# Altium schematic sheet IO.SchDoc
size A3; SheetNumber: 4; SheetTotal: 14
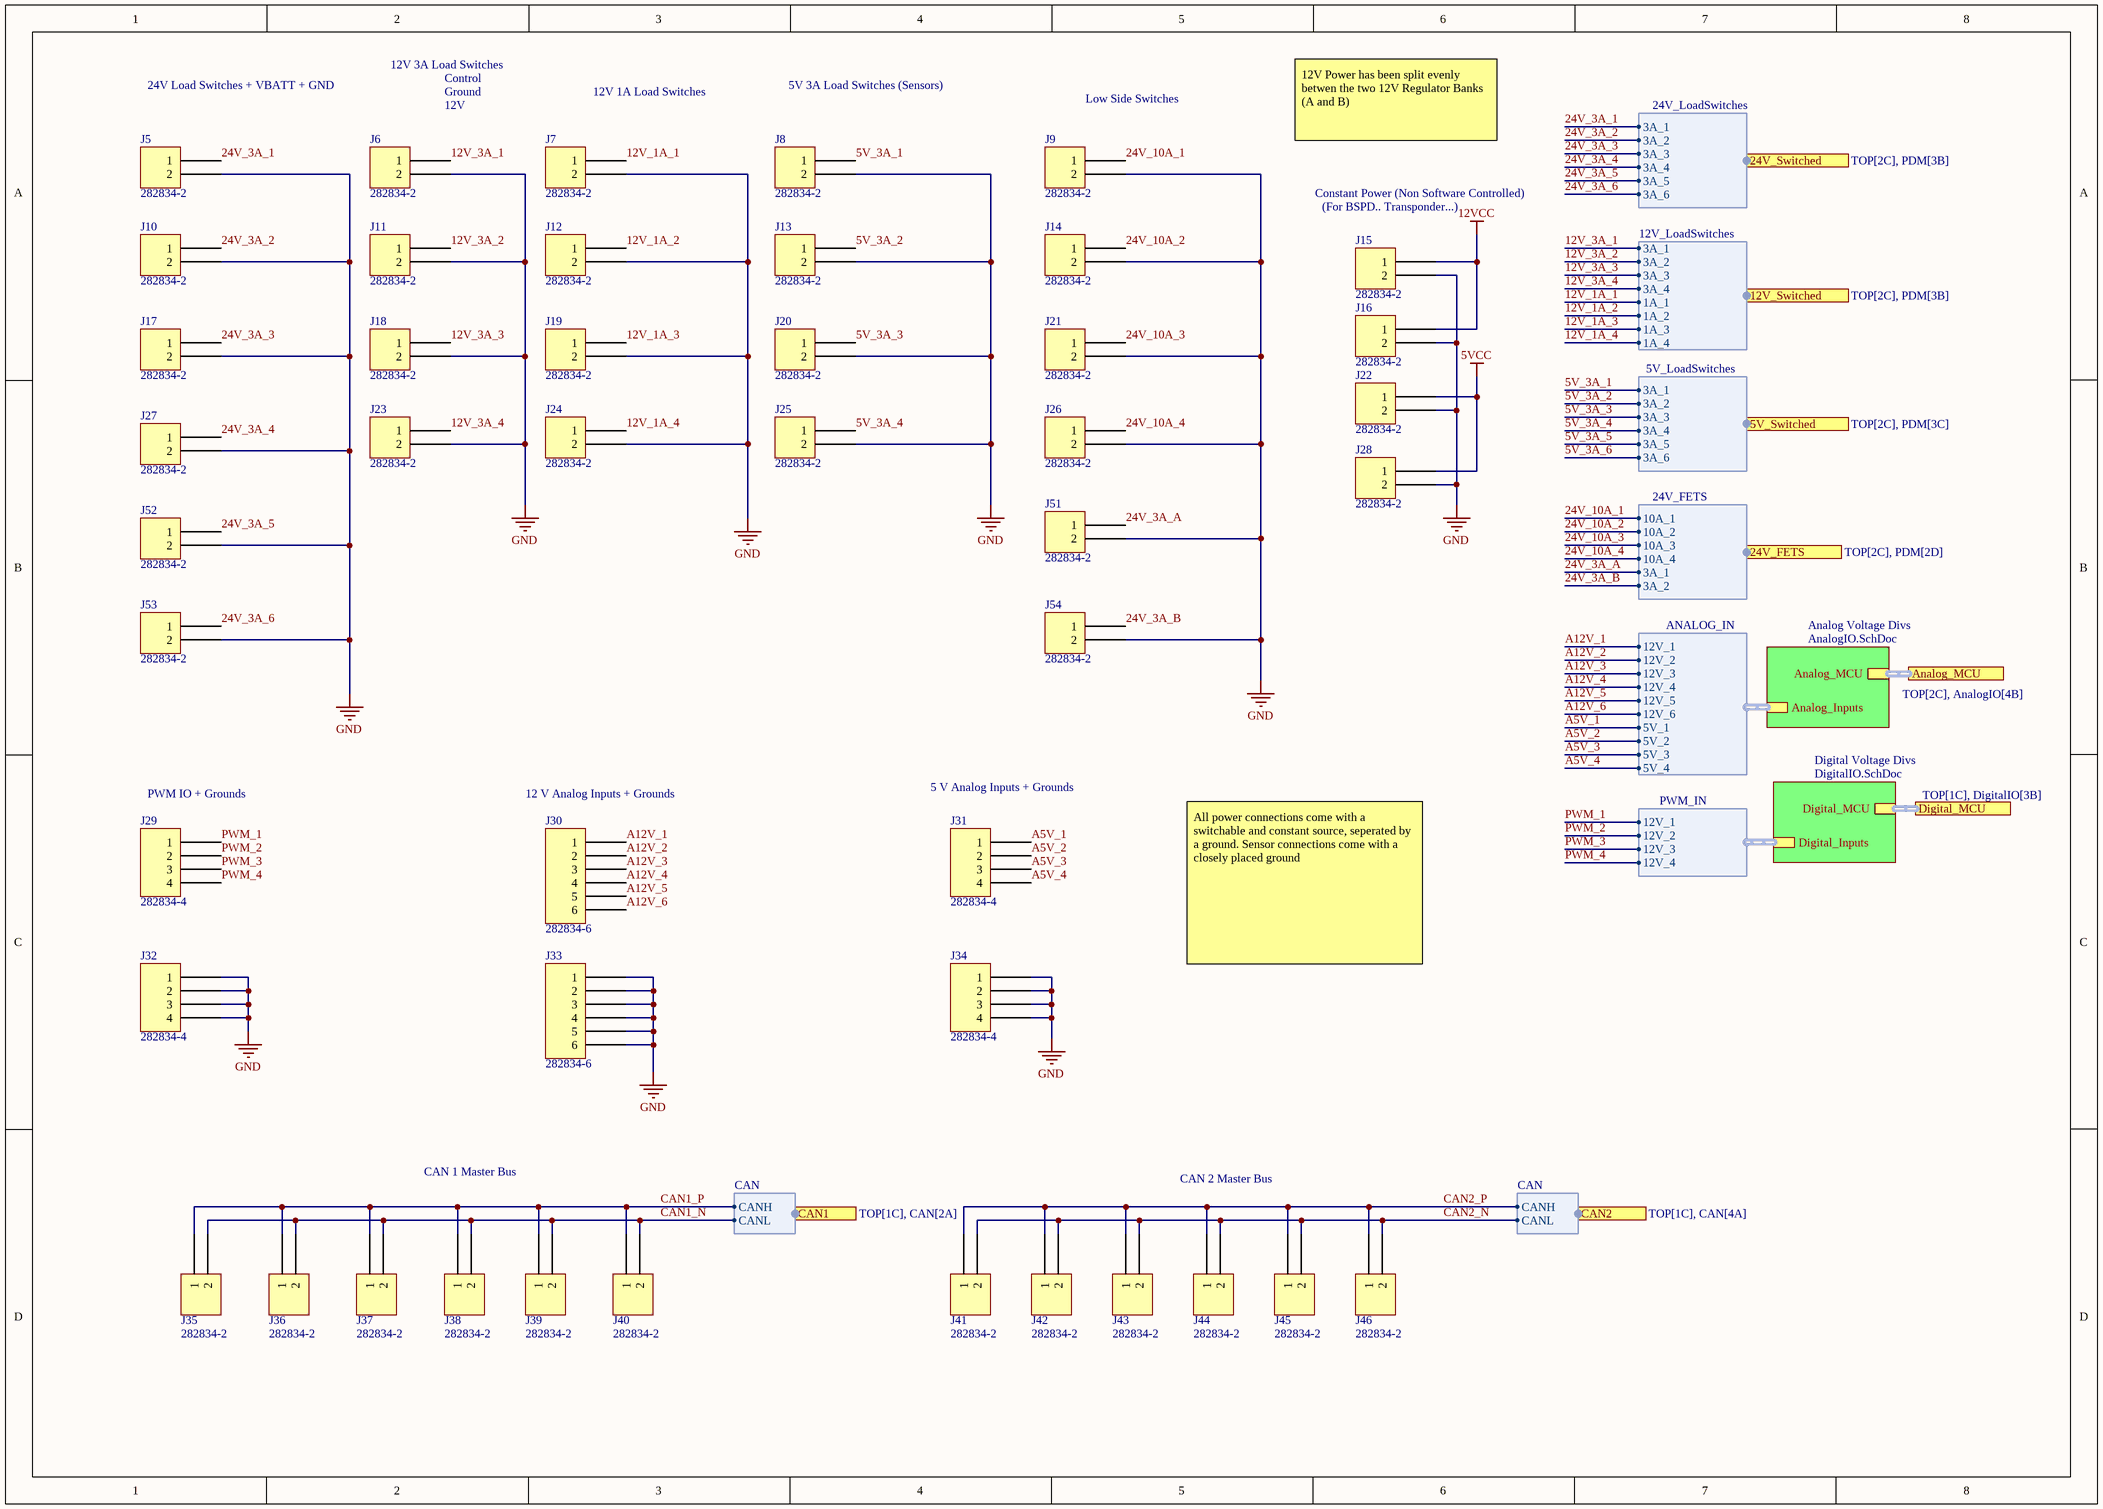
[diagram p0: IO.SchDoc]

## Parts
J5  282834-2  [TE 282834-2]
J6  282834-2  [TE 282834-2]
J7  282834-2  [TE 282834-2]
J8  282834-2  [TE 282834-2]
J9  282834-2  [TE 282834-2]
J10  282834-2  [TE 282834-2]
J11  282834-2  [TE 282834-2]
J12  282834-2  [TE 282834-2]
J13  282834-2  [TE 282834-2]
J14  282834-2  [TE 282834-2]
J15  282834-2  [TE 282834-2]
J16  282834-2  [TE 282834-2]
J17  282834-2  [TE 282834-2]
J18  282834-2  [TE 282834-2]
J19  282834-2  [TE 282834-2]
J20  282834-2  [TE 282834-2]
J21  282834-2  [TE 282834-2]
J22  282834-2  [TE 282834-2]
J23  282834-2  [TE 282834-2]
J24  282834-2  [TE 282834-2]
J25  282834-2  [TE 282834-2]
J26  282834-2  [TE 282834-2]
J27  282834-2  [TE 282834-2]
J28  282834-2  [TE 282834-2]
J29  282834-4  [TE 282834-4]
J30  282834-6  [TE 282834-6]
J31  282834-4  [TE 282834-4]
J32  282834-4  [TE 282834-4]
J33  282834-6  [TE 282834-6]
J34  282834-4  [TE 282834-4]
J35  282834-2  [TE 282834-2]
J36  282834-2  [TE 282834-2]
J37  282834-2  [TE 282834-2]
J38  282834-2  [TE 282834-2]
J39  282834-2  [TE 282834-2]
J40  282834-2  [TE 282834-2]
J41  282834-2  [TE 282834-2]
J42  282834-2  [TE 282834-2]
J43  282834-2  [TE 282834-2]
J44  282834-2  [TE 282834-2]
J45  282834-2  [TE 282834-2]
J46  282834-2  [TE 282834-2]
J51  282834-2  [TE 282834-2]
J52  282834-2  [TE 282834-2]
J53  282834-2  [TE 282834-2]
J54  282834-2  [TE 282834-2]

## Sub-sheets
Analog Voltage Divs = AnalogIO.SchDoc: Analog_Inputs (harness ANALOG_IN), Analog_MCU (harness ANALOG_IN)
Digital Voltage Divs = DigitalIO.SchDoc: Digital_Inputs (harness PWM_IN), Digital_MCU (harness PWM_IN)

## Ports
5V_Switched (harness 5V_LoadSwitches, see TOP[2C], PDM[3C]), 12V_Switched (harness 12V_LoadSwitches, see TOP[2C], PDM[3B]), 24V_FETS (harness 24V_FETS, see TOP[2C], PDM[2D]), 24V_Switched (harness 24V_LoadSwitches, see TOP[2C], PDM[3B]), Analog_MCU (harness ANALOG_IN, see TOP[2C], AnalogIO[4B]), CAN1 (harness CAN, see TOP[1C], CAN[2A]), CAN2 (harness CAN, see TOP[1C], CAN[4A]), Digital_MCU (harness PWM_IN, see TOP[1C], DigitalIO[3B])

## Harnesses
24V_LoadSwitches: 3A_1, 3A_2, 3A_3, 3A_4, 3A_5, 3A_6
12V_LoadSwitches: 3A_1, 3A_2, 3A_3, 3A_4, 1A_1, 1A_2, 1A_3, 1A_4
5V_LoadSwitches: 3A_1, 3A_2, 3A_3, 3A_4, 3A_5, 3A_6
24V_FETS: 10A_1, 10A_2, 10A_3, 10A_4, 3A_1, 3A_2
ANALOG_IN: 12V_1, 12V_2, 12V_3, 12V_4, 12V_5, 12V_6, 5V_1, 5V_2, 5V_3, 5V_4
PWM_IN: 12V_1, 12V_2, 12V_3, 12V_4
CAN: CANH, CANL

## Nets
5VCC: J22.1 J28.1
12VCC: J15.1 J16.1
GND: J5.2 J6.2 J7.2 J8.2 J9.2 J10.2 J11.2 J12.2 J13.2 J14.2 J15.2 J16.2 J17.2 J18.2 J19.2 J20.2 J21.2 J22.2 J23.2 J24.2 J25.2 J26.2 J27.2 J28.2 J32.1 J32.2 J32.3 J32.4 J33.1 J33.2 J33.3 J33.4 J33.5 J33.6 J34.1 J34.2 J34.3 J34.4 J51.2 J52.2 J53.2 J54.2
5V_3A_1: J8.1 ; port 5V_Switched.3A_1
5V_3A_2: J13.1 ; port 5V_Switched.3A_2
5V_3A_3: J20.1 ; port 5V_Switched.3A_3
5V_3A_4: J25.1 ; port 5V_Switched.3A_4
5V_3A_5: port 5V_Switched.3A_5
5V_3A_6: port 5V_Switched.3A_6
12V_1A_1: J7.1 ; port 12V_Switched.1A_1
12V_1A_2: J12.1 ; port 12V_Switched.1A_2
12V_1A_3: J19.1 ; port 12V_Switched.1A_3
12V_1A_4: J24.1 ; port 12V_Switched.1A_4
12V_3A_1: J6.1 ; port 12V_Switched.3A_1
12V_3A_2: J11.1 ; port 12V_Switched.3A_2
12V_3A_3: J18.1 ; port 12V_Switched.3A_3
12V_3A_4: J23.1 ; port 12V_Switched.3A_4
24V_3A_1: J5.1 ; port 24V_Switched.3A_1
24V_3A_2: J10.1 ; port 24V_Switched.3A_2
24V_3A_3: J17.1 ; port 24V_Switched.3A_3
24V_3A_4: J27.1 ; port 24V_Switched.3A_4
24V_3A_5: J52.1 ; port 24V_Switched.3A_5
24V_3A_6: J53.1 ; port 24V_Switched.3A_6
24V_3A_A: J51.1 ; port 24V_FETS.3A_1
24V_3A_B: J54.1 ; port 24V_FETS.3A_2
24V_10A_1: J9.1 ; port 24V_FETS.10A_1
24V_10A_2: J14.1 ; port 24V_FETS.10A_2
24V_10A_3: J21.1 ; port 24V_FETS.10A_3
24V_10A_4: J26.1 ; port 24V_FETS.10A_4
A5V_1: J31.1 ; sheet Analog Voltage Divs/Analog_Inputs.5V_1
A5V_2: J31.2 ; sheet Analog Voltage Divs/Analog_Inputs.5V_2
A5V_3: J31.3 ; sheet Analog Voltage Divs/Analog_Inputs.5V_3
A5V_4: J31.4 ; sheet Analog Voltage Divs/Analog_Inputs.5V_4
A12V_1: J30.1 ; sheet Analog Voltage Divs/Analog_Inputs.12V_1
A12V_2: J30.2 ; sheet Analog Voltage Divs/Analog_Inputs.12V_2
A12V_3: J30.3 ; sheet Analog Voltage Divs/Analog_Inputs.12V_3
A12V_4: J30.4 ; sheet Analog Voltage Divs/Analog_Inputs.12V_4
A12V_5: J30.5 ; sheet Analog Voltage Divs/Analog_Inputs.12V_5
A12V_6: J30.6 ; sheet Analog Voltage Divs/Analog_Inputs.12V_6
CAN1_N: J35.2 J36.2 J37.2 J38.2 J39.2 J40.2 ; port CAN1.CANL
CAN1_P: J35.1 J36.1 J37.1 J38.1 J39.1 J40.1 ; port CAN1.CANH
CAN2_N: J41.2 J42.2 J43.2 J44.2 J45.2 J46.2 ; port CAN2.CANL
CAN2_P: J41.1 J42.1 J43.1 J44.1 J45.1 J46.1 ; port CAN2.CANH
PWM_1: J29.1 ; sheet Digital Voltage Divs/Digital_Inputs.12V_1
PWM_2: J29.2 ; sheet Digital Voltage Divs/Digital_Inputs.12V_2
PWM_3: J29.3 ; sheet Digital Voltage Divs/Digital_Inputs.12V_3
PWM_4: J29.4 ; sheet Digital Voltage Divs/Digital_Inputs.12V_4

## Buses and harness runs
harness port Analog_MCU = sheet Analog Voltage Divs/Analog_MCU
harness port Digital_MCU = sheet Digital Voltage Divs/Digital_MCU

## Notes on the sheet
- 24V Load Switches + VBATT + GND
- 12V 3A Load Switches
- Control
- Ground
- 12V
- 12V 1A Load Switches
- 5V 3A Load Switches (Sensors)
- Low Side Switches
- 12V Power has been split evenly betwen the two 12V Regulator Banks (A and B)
- Constant Power (Non Software Controlled)
- (near J15) (For BSPD.. Transponder...)
- (near J29) PWM IO + Grounds
- (near J30) 12 V Analog Inputs + Grounds
- (near J31) 5 V Analog Inputs + Grounds
- All power connections come with a switchable and constant source, seperated by a ground. Sensor connections come with a closely placed ground
- CAN 1 Master Bus
- CAN 2 Master Bus

## Library data of the parts
J5-J28 J35-J46 J51-J54 = 282834-2: TERM BLK 2P SIDE ENT 2.54MM PCB; Part Number: 282834-2
J29 J31 J32 J34 = 282834-4: TERM BLK 4P SIDE ENT 2.54MM PCB; Part Number: 282834-4
J30 J33 = 282834-6: TERM BLK 6P SIDE ENT 2.54MM PCB; Part Number: 282834-6